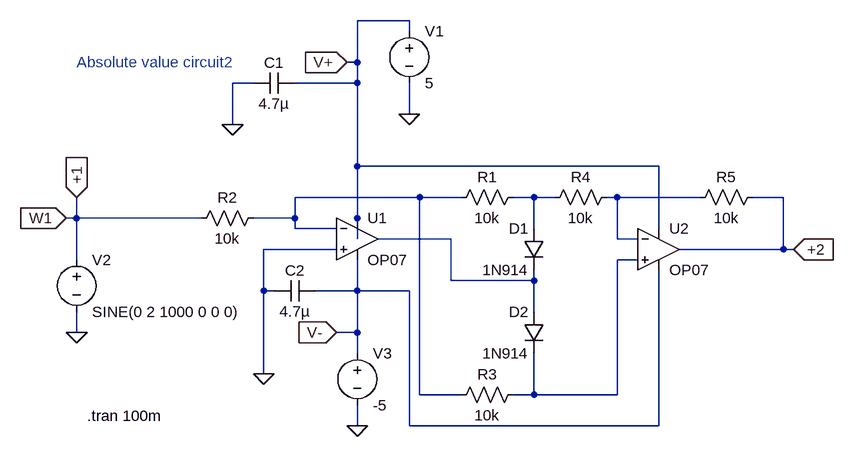
[diagram p0: schematic abs_value_cir2.asc]
abs_value_cir2.asc, the LTspice schematic file:
Version 4
SHEET 1 880 680
WIRE -80 -80 -160 -80
WIRE -80 -64 -80 -80
WIRE -160 -16 -160 -80
WIRE -160 -16 -176 -16
WIRE -320 16 -352 16
WIRE -160 16 -160 -16
WIRE -160 16 -256 16
WIRE -80 64 -80 16
WIRE -352 80 -352 16
WIRE -160 144 -160 16
WIRE 304 144 -160 144
WIRE -64 192 -256 192
WIRE 0 192 -64 192
WIRE 112 192 80 192
WIRE 144 192 112 192
WIRE 240 192 224 192
WIRE 368 192 240 192
WIRE 496 192 448 192
WIRE -592 224 -592 192
WIRE -592 224 -608 224
WIRE -400 224 -592 224
WIRE -256 224 -256 192
WIRE -256 224 -320 224
WIRE -160 224 -160 144
WIRE -256 240 -256 224
WIRE -192 240 -256 240
WIRE 112 240 112 192
WIRE 304 240 304 144
WIRE -160 256 -160 224
WIRE -16 256 -128 256
WIRE 240 256 240 192
WIRE 272 256 240 256
WIRE -192 272 -304 272
WIRE 496 272 496 192
WIRE 496 272 336 272
WIRE 512 272 496 272
WIRE -592 288 -592 224
WIRE 272 288 240 288
WIRE -16 320 -16 256
WIRE 112 320 112 304
WIRE 112 320 -16 320
WIRE -304 336 -304 272
WIRE -288 336 -304 336
WIRE -160 336 -160 288
WIRE -160 336 -224 336
WIRE -80 336 -160 336
WIRE 112 368 112 320
WIRE -592 400 -592 368
WIRE -160 400 -160 336
WIRE -160 400 -192 400
WIRE -160 432 -160 400
WIRE -304 464 -304 336
WIRE -64 496 -64 192
WIRE 0 496 -64 496
WIRE 112 496 112 432
WIRE 112 496 80 496
WIRE 240 496 240 288
WIRE 240 496 112 496
WIRE -160 544 -160 512
WIRE -80 544 -80 336
WIRE 304 544 304 304
WIRE 304 544 -80 544
FLAG -80 64 0
FLAG -352 80 0
FLAG -592 400 0
FLAG -160 544 0
FLAG -304 464 0
FLAG -176 -16 V+
IOPIN -176 -16 In
FLAG -192 400 V-
IOPIN -192 400 In
FLAG -608 224 W1
IOPIN -608 224 In
FLAG -592 192 +1
IOPIN -592 192 In
FLAG 512 272 +2
IOPIN 512 272 In
SYMBOL voltage -80 -80 R0
WINDOW 123 0 0 Left 0
WINDOW 39 0 0 Left 0
SYMATTR InstName V1
SYMATTR Value 5
SYMBOL Opamps\\OP07 -160 192 R0
SYMATTR InstName U1
SYMBOL cap -256 0 R90
WINDOW 0 0 32 VBottom 2
WINDOW 3 32 32 VTop 2
SYMATTR InstName C1
SYMATTR Value 4.7µ
SYMBOL res 96 176 R90
WINDOW 0 0 56 VBottom 2
WINDOW 3 32 56 VTop 2
SYMATTR InstName R1
SYMATTR Value 10k
SYMBOL res -304 208 R90
WINDOW 0 0 56 VBottom 2
WINDOW 3 32 56 VTop 2
SYMATTR InstName R2
SYMATTR Value 10k
SYMBOL voltage -592 272 R0
WINDOW 123 0 0 Left 0
WINDOW 39 0 0 Left 0
SYMATTR InstName V2
SYMATTR Value SINE(0 2 1000 0 0 0)
SYMBOL voltage -160 416 R0
WINDOW 123 0 0 Left 0
WINDOW 39 0 0 Left 0
SYMATTR InstName V3
SYMATTR Value -5
SYMBOL cap -224 320 R90
WINDOW 0 0 32 VBottom 2
WINDOW 3 32 32 VTop 2
SYMATTR InstName C2
SYMATTR Value 4.7µ
SYMBOL diode 128 240 M0
SYMATTR InstName D1
SYMATTR Value 1N914
SYMBOL diode 128 368 M0
SYMATTR InstName D2
SYMATTR Value 1N914
SYMBOL res 96 480 R90
WINDOW 0 0 56 VBottom 2
WINDOW 3 32 56 VTop 2
SYMATTR InstName R3
SYMATTR Value 10k
SYMBOL res 240 176 R90
WINDOW 0 0 56 VBottom 2
WINDOW 3 32 56 VTop 2
SYMATTR InstName R4
SYMATTR Value 10k
SYMBOL Opamps\\OP07 304 208 R0
SYMATTR InstName U2
SYMBOL res 464 176 R90
WINDOW 0 0 56 VBottom 2
WINDOW 3 32 56 VTop 2
SYMATTR InstName R5
SYMATTR Value 10k
TEXT -592 -16 Left 2 ;Absolute value circuit2
TEXT -576 528 Left 2 !.tran 100m

The netlist it stands for:
* abs_value_cir2.asc
V1 V+ 0 5
XU1 0 N001 V+ V- N004 LT1001  ; OP07, pins In+ In- V+ V- OUT
C1 V+ 0 4.7µ
R1 N002 N001 10k
R2 N001 +1 10k
V2 +1 0 SINE(0 2 1000 0 0 0)
V3 V- 0 -5
C2 V- 0 4.7µ
D1 N002 N004 1N914
D2 N004 N005 1N914
R3 N005 N001 10k
R4 N003 N002 10k
XU2 N005 N003 V+ V- +2 LT1001  ; OP07, pins In+ In- V+ V- OUT
R5 +2 N003 10k
.model D D
.lib standard.dio
* Absolute value circuit2
.tran 100m
.lib LTC.lib
.backanno
.end